# EAGLE design tiny84v2 (EAGLE 9.6.2)
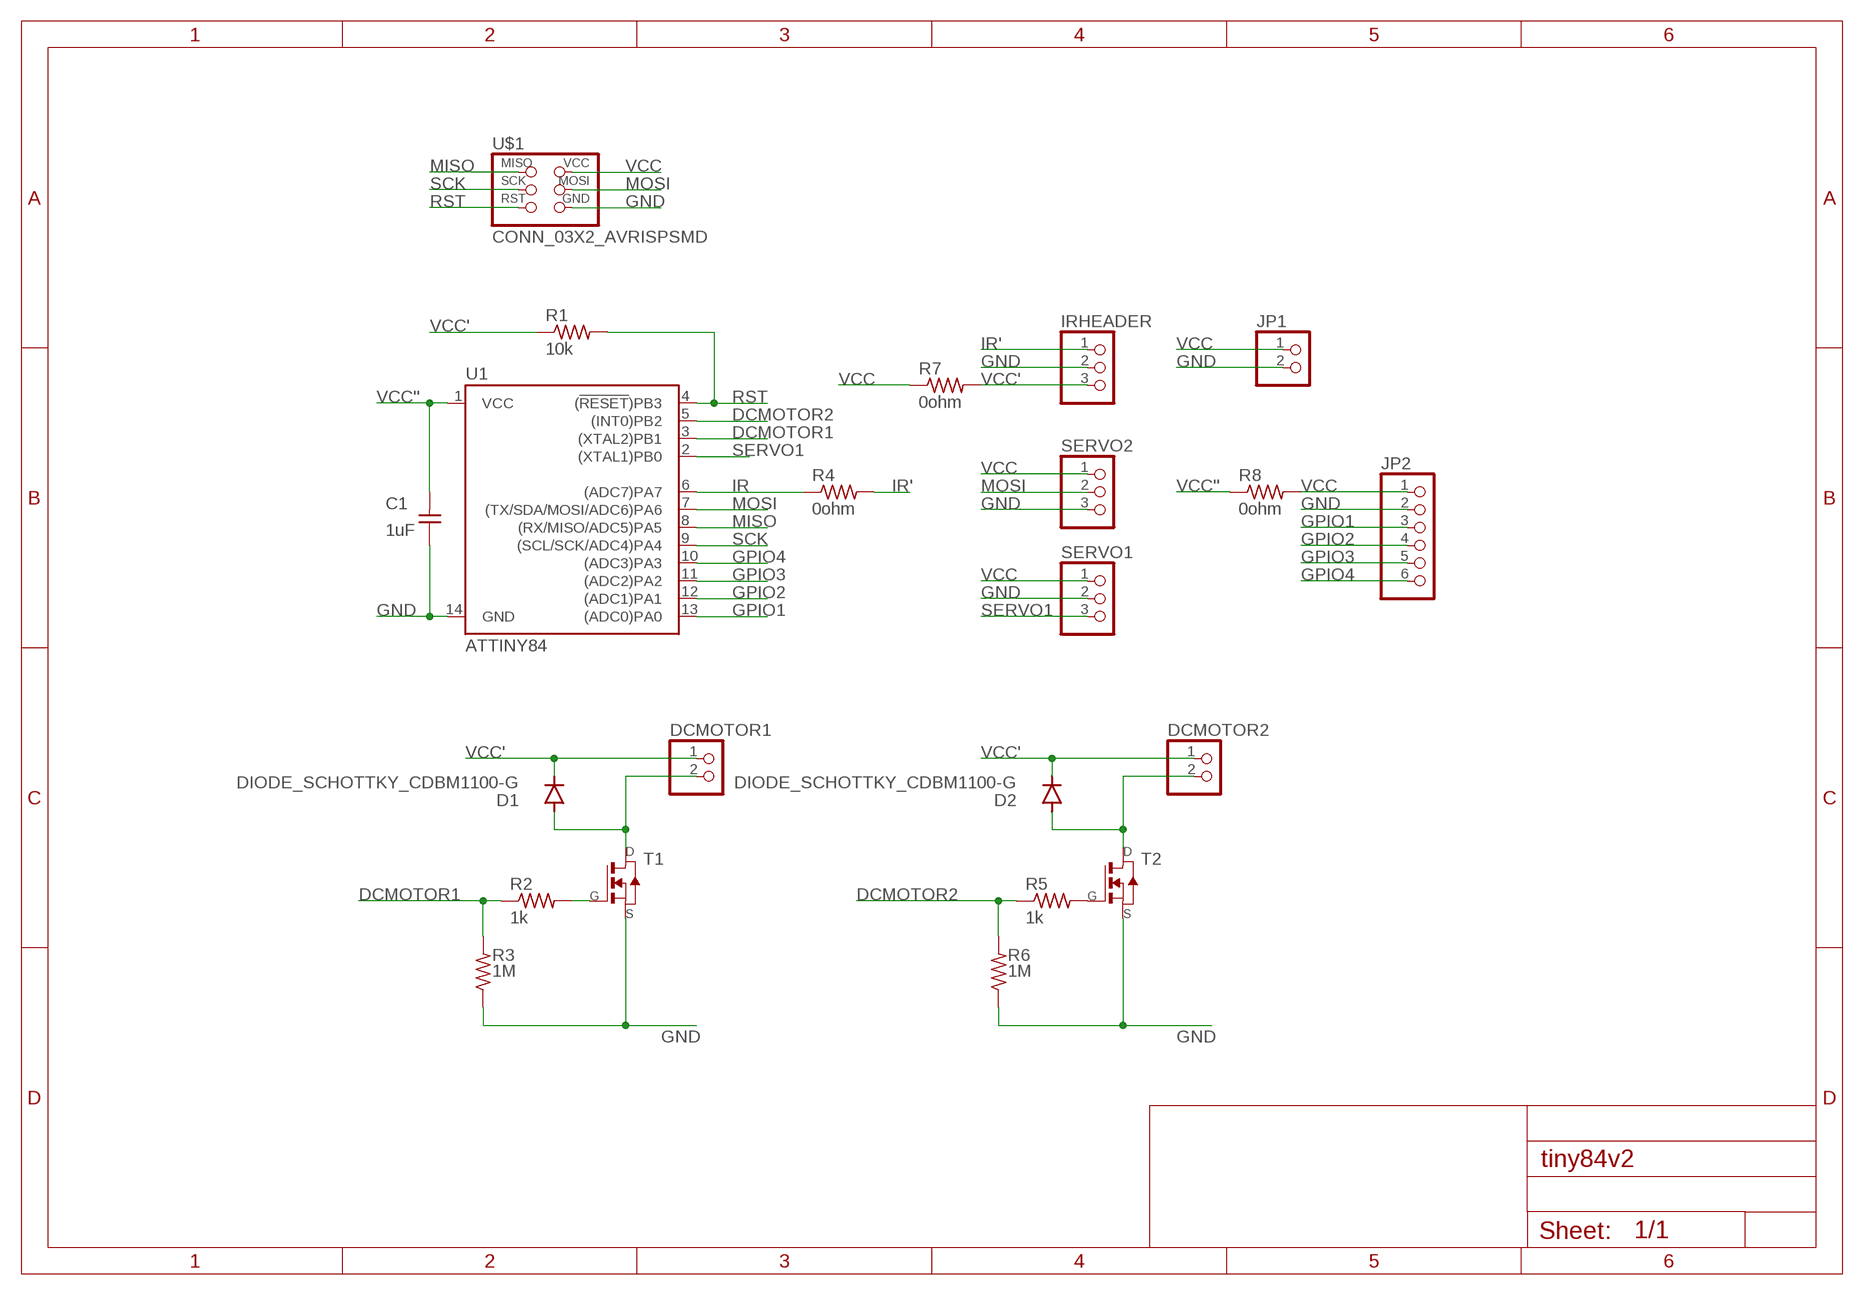
[diagram p0: schematic, sheet 1]

## Parts
C1  1uF  CAP_UNPOLARIZEDFAB  [C1206FAB]
D1  DIODE_SCHOTTKY_CDBM1100-G  [MINI-SMA]
D2  DIODE_SCHOTTKY_CDBM1100-G  [MINI-SMA]
DCMOTOR1  PINHD-1X2  [1X02]
DCMOTOR2  PINHD-1X2  [1X02]
IRHEADER  PINHD-1X3  [1X03]
JP1  PINHD-1X2  [1X02]
JP2  PINHD-1X6  [1X06]
R1  10k  R1206FAB  [R1206FAB]
R2  1k  R1206FAB  [R1206FAB]
R3  1M  R1206FAB  [R1206FAB]
R4  0ohm  R1206FAB  [R1206FAB]
R5  1k  R1206FAB  [R1206FAB]
R6  1M  R1206FAB  [R1206FAB]
R7  0ohm  R1206FAB  [R1206FAB]
R8  0ohm  R1206FAB  [R1206FAB]
SERVO1  PINHD-1X3  [1X03]
SERVO2  PINHD-1X3  [1X03]
T1  MOSFET_NSOT23  [SOT-23]
T2  MOSFET_NSOT23  [SOT-23]
U1  ATTINY84  [SO14]
U$1  CONN_03X2_AVRISPSMD  [2X03SMD]

## Nets
DCMOTOR1: R2.1 R3.2 U1.3((XTAL2)PB1)
DCMOTOR2: R5.1 R6.2 U1.5((INT0)PB2)
GND: C1.1 IRHEADER.2 JP1.2 JP2.2 R3.1 R6.1 SERVO1.2 SERVO2.3 T1.2(S) T2.2(S) U1.14(GND) U$1.6(GND)
GPIO1: JP2.3 U1.13((ADC0)PA0)
GPIO2: JP2.4 U1.12((ADC1)PA1)
GPIO3: JP2.5 U1.11((ADC2)PA2)
GPIO4: JP2.6 U1.10((ADC3)PA3)
IR: R4.1 U1.6((ADC7)PA7)
IR': IRHEADER.1 R4.2
MISO: U1.8((RX/MISO/ADC5)PA5) U$1.1(MISO)
MOSI: SERVO2.2 U1.7((TX/SDA/MOSI/ADC6)PA6) U$1.4(MOSI)
N$2: D2.ANODE DCMOTOR2.2 T2.1(D)
N$3: D1.ANODE DCMOTOR1.2 T1.1(D)
N$4: R2.2 T1.3(G)
N$5: R5.2 T2.3(G)
RST: R1.2 U1.4((!RESET!)PB3) U$1.5(RST)
SCK: U1.9((SCL/SCK/ADC4)PA4) U$1.3(SCK)
SERVO1: SERVO1.3 U1.2((XTAL1)PB0)
VCC: JP1.1 JP2.1 R7.1 R8.2 SERVO1.1 SERVO2.1 U$1.2(VCC)
VCC': D1.KATHODE D2.KATHODE DCMOTOR1.1 DCMOTOR2.1 IRHEADER.3 R1.1 R7.2
VCC'': C1.2 R8.1 U1.1(VCC)

## Library data of the parts
C1 = eagle_fab:CAP_UNPOLARIZED
D1 D2 = eagle_fab:DIODE_SCHOTTKY_CDBM1100-G: Diode schottky 100V 1A mini-SMA as found in the fablab inventory Reverse Voltage: 100 Volts Forward Current: 1.0 Amp Maximum forward voltage: 0.85 Volts Made by Zaerc.
DCMOTOR1 DCMOTOR2 JP1 = pinhead:PINHD-1X2: PIN HEADER
IRHEADER SERVO1 SERVO2 = pinhead:PINHD-1X3: PIN HEADER
JP2 = pinhead:PINHD-1X6: PIN HEADER
R1-R8 = eagle_fab:R: Resistor (US Symbol) Variants with postfix FAB are widened to allow the routing of internal traces
T1 T2 = eagle_fab:MOSFET_N: MOS FET
U1 = SparkFun-IC-Microcontroller:ATTINY84: Atmel 14-pin 2/4/8kB flash uC Datasheet <https://cdn.sparkfun.com/datasheets/Widgets/doc8006.pdf> SparkFun Products Tiny AVR Programmer <https://www.sparkfun.com/products/11801> (PGM-11801) SparkFun Servo Trigger - Continuous Rotation <https://www.sparkfun.com/products/13872> (WIG-13872) SparkFun Servo Trigger <https://www.sparkfun.com/products/13118> (WIG-13118); PROD_ID: IC-11285
U$1 = eagle_fab:CONN_03X2_AVRISP

## Board
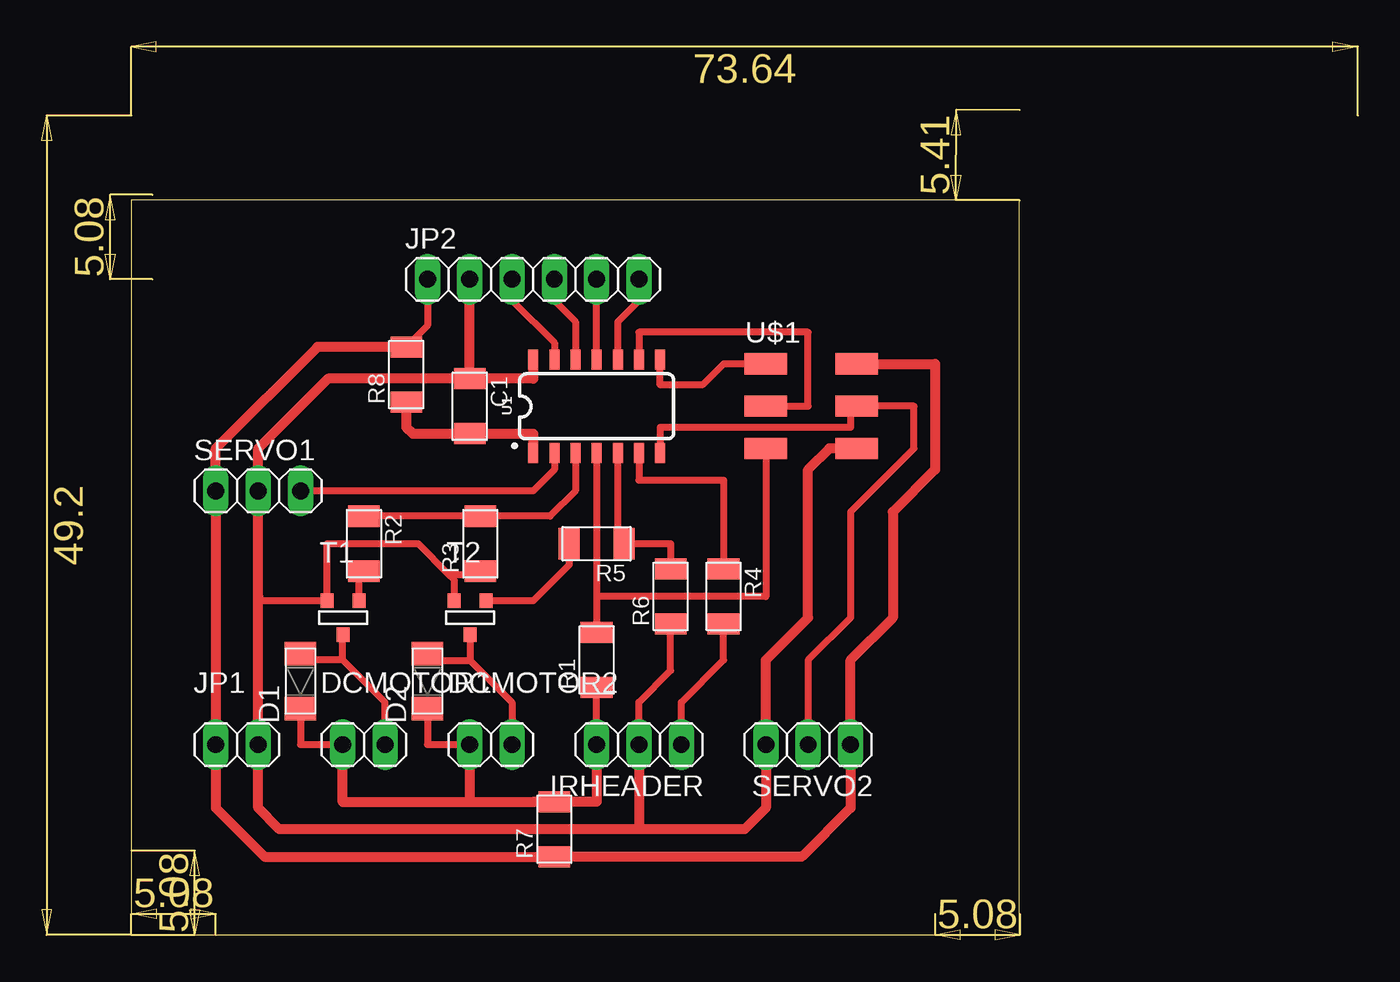
[diagram p1: board, top side]

Size 53.32 x 44.12 mm. Coordinates in mm from the lower left corner, seen from the top.
Outline: 0,0 53.32,0 53.32,44.12 0,44.12 0,0
Copper layers (1*16): Top 0.035mm / dielectric 1.5mm / Bottom 0.035mm
Design rules "default *": minimum track width 16mil, minimum drill 0.35mm, track to track 16mil, track to pad 16mil, pad to pad 16mil, via to via 6mil, smd to smd 6mil, copper to edge 40mil, drill to drill 6mil, minimum pad ring 10mil, minimum via ring 8mil, stop-mask expansion 4mil, vias tented up to drill 0mil, thermal gap 10mil

### Footprints (pad centres in the part's own frame; a part is rotated, then mirrored left to right if it is on the bottom)
C1206FAB = smd 1.27 x 1.905: 1 -1.651,0; 2 1.651,0
MINI-SMA = smd 1.4 x 1.9: ANODE 1.65,0; KATHODE -1.65,0
1X02 = drill 1.016 long: 1 -1.27,0; 2 1.27,0
1X03 = drill 1.016 long: 1 -2.54,0; 2 0,0; 3 2.54,0
1X06 = drill 1.016 long: 1 -6.35,0; 2 -3.81,0; 3 -1.27,0; 4 1.27,0; 5 3.81,0; 6 6.35,0
R1206FAB = smd 1.27 x 1.905: 1 -1.651,0; 2 1.651,0
SOT-23 = smd 0.787 x 0.889: 1 0.025,-1.016; 2 -0.94,1.016; 3 0.991,1.016
SO14 = smd 0.6 x 1.2: 1 -3.81,-2.8; 2 -2.54,-2.8; 3 -1.27,-2.8; 4 0,-2.8; 5 1.27,-2.8; 6 2.54,-2.8; 7 3.81,-2.8; 8 3.81,2.8; 9 2.54,2.8; 10 1.27,2.8; 11 0,2.8; 12 -1.27,2.8; 13 -2.54,2.8; 14 -3.81,2.8
2X03SMD = smd 2.54 x 1.27: 1 -2.54,2.54; 2 2.92,2.54; 3 -2.54,0; 4 2.92,0; 5 -2.54,-2.54; 6 2.92,-2.54

### Placement (x,y rotation side)
C1  20.32,31.75 270 top
D1  10.16,15.24 90 top
D2  17.78,15.24 90 top
DCMOTOR1  13.97,11.43 0 top
DCMOTOR2  21.59,11.43 0 top
IRHEADER  30.48,11.43 180 top
JP1  6.35,11.43 0 top
JP2  24.13,39.37 0 top
R1  27.94,16.51 90 top
R2  13.97,23.5 270 top
R3  20.95,23.5 90 top
R4  35.56,20.32 270 top
R5  27.94,23.5 180 top
R6  32.38,20.32 90 top
R7  25.4,6.35 90 top
R8  16.51,33.66 90 top
SERVO1  7.62,26.67 0 top
SERVO2  40.64,11.43 180 top
T1  12.7,19.05 0 top
T2  20.32,19.05 0 top
U1  27.94,31.75 0 top
U$1  40.64,31.75 0 top

### Tracks (layer width: path | path; a pad name or v marks a point on that pad's centre or on a via)
DCMOTOR1
  Top 0.406: R2.1 R3.2 25.15,25.15 26.67,26.67 U1.3
DCMOTOR2
  Top 0.406: U1.5 29.21,23.88 R5.1 32.38,23.5 R6.2
GND
  Top 0.406: T2.2 19.38,21.34 19.09,21.63 | 19.09,21.63 17.22,23.5 11.76,23.5 T1.2 7.87,20.07 7.62,20.32 | R3.1 20.95,21.63 19.09,21.63 | IRHEADER.2 30.48,13.97 32.38,15.88 R6.1
  Top 0.61: U$1.6 41.91,29.21 40.64,27.94 40.64,19.05 38.1,16.51 SERVO2.3 38.1,7.62 36.83,6.35 30.48,6.35 | 30.48,6.35 8.89,6.35 7.62,7.62 JP1.2 7.62,20.32 SERVO1.2 7.62,29.21 11.81,33.4 C1.1 | IRHEADER.2 30.48,6.35 | U1.14 24.13,33.4 C1.1 | C1.1 JP2.2
GPIO1
  Top 0.406: JP2.3 22.86,38.1 25.4,35.56 U1.13
GPIO2
  Top 0.406: JP2.4 25.4,38.1 26.67,36.83 U1.12
GPIO3
  Top 0.406: U1.11 JP2.5
GPIO4
  Top 0.406: U1.10 29.21,36.83 30.48,38.1 JP2.6
IR
  Top 0.406: U1.6 30.48,27.3 35.56,27.3 R4.1
IR'
  Top 0.406: IRHEADER.1 33.02,13.97 35.56,16.51 R4.2
MISO
  Top 0.406: U$1.1 35.56,34.29 34.29,33.02 31.75,33.02 U1.8
MOSI
  Top 0.406: U1.7 31.75,30.48 43.18,30.48 43.18,31.37 U$1.4 46.99,31.75 46.99,29.21 43.18,25.4 43.18,19.05 40.64,16.51 SERVO2.2
N$2
  Top 0.406: T2.1 20.34,16.48 | 20.34,16.48 22.86,13.97 DCMOTOR2.2 | D2.ANODE 18.18,16.48 20.34,16.48
N$3
  Top 0.406: DCMOTOR1.2 15.24,13.97 12.7,16.51 | 12.7,16.51 12.7,18.01 T1.1 | D1.ANODE 10.54,16.51 12.7,16.51
N$4
  Top 0.406: T1.3 13.69,21.84 R2.2
N$5
  Top 0.406: R5.2 26.29,22.23 24.13,20.07 T2.3
RST
  Top 0.406: U$1.5 38.1,20.32 27.94,20.32 | U1.4 27.94,20.32 | 27.94,20.32 R1.2
SCK
  Top 0.406: U1.9 30.48,36.2 40.64,36.2 40.64,31.75 U$1.3
SERVO1
  Top 0.406: U1.2 25.4,27.94 24.13,26.67 SERVO1.3
VCC
  Top 0.406: JP2.1 17.78,36.58 R8.2
  Top 0.61: U$1.2 48.26,34.29 48.26,27.94 45.72,25.4 45.72,19.05 43.18,16.51 SERVO2.1 43.18,7.62 40.26,4.7 R7.1 8,4.7 5.08,7.62 JP1.1 SERVO1.1 5.08,29.21 11.18,35.31 R8.2
VCC'
  Top 0.406: D1.KATHODE 10.16,11.43 DCMOTOR1.1 | D2.KATHODE 17.78,11.43 DCMOTOR2.1 | IRHEADER.3 R1.1
  Top 0.61: IRHEADER.3 27.94,8 R7.2 24.18,8 24.18,7.98 20.32,7.98 | DCMOTOR2.1 20.32,7.98 | 20.32,7.98 12.7,7.98 DCMOTOR1.1
VCC''
  Top 0.61: R8.1 16.51,30.48 16.89,30.1 C1.2 24.13,30.1 U1.1